# Altium schematic sheet msp430g2553.SchDoc
size A4
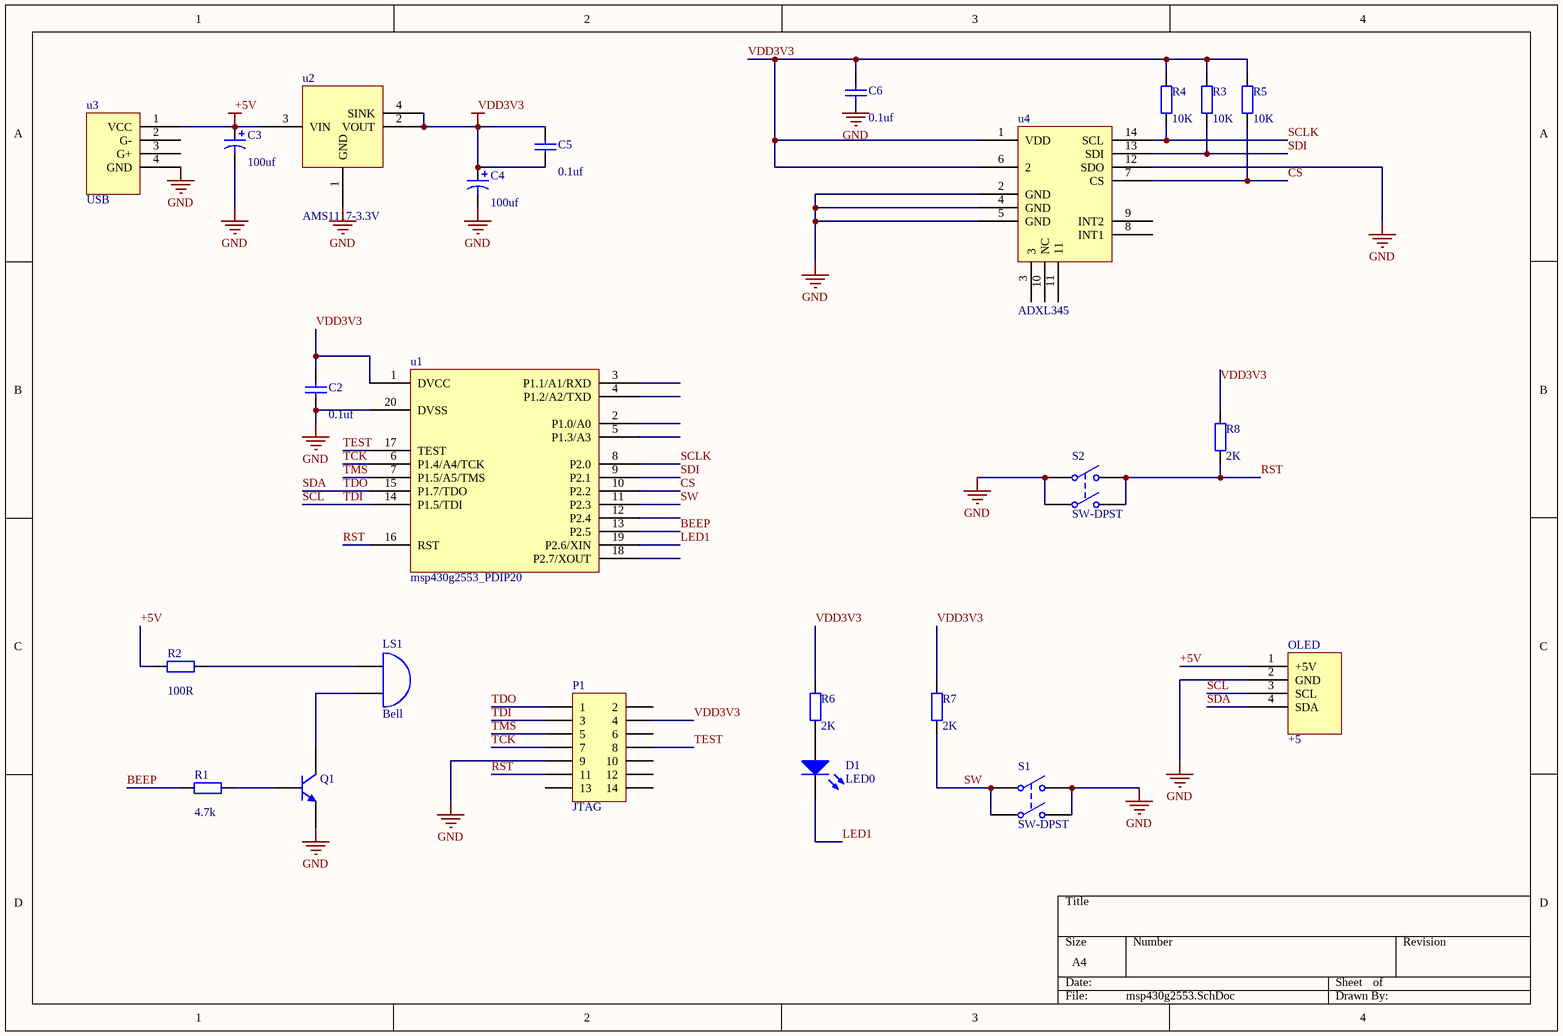
[diagram p0: msp430g2553.SchDoc]

## Parts
C2  value 0.1uf  [6-0805_N]  (hidden comment: Cap)
C3  value 100uf  [Cap2_polar]  (hidden comment: Cap Pol2)
C4  value 100uf  [Cap2_polar]  (hidden comment: Cap Pol2)
C5  value 0.1uf  [6-0805_N]  (hidden comment: Cap)
C6  value 0.1uf  [6-0805_N]  (hidden comment: Cap)
D1  LED0  [6-0805_N - duplicate]
LS1  Bell  [bell]
OLED  +5  [OLED]
P1  JTAG  [HDR2X7]
Q1  NPN  [SOT23_N]  (value not drawn)
R1  value 4.7k  [6-0805_N]  (hidden comment: Res2)
R2  value 100R  [6-0805_N]  (hidden comment: Res2)
R3  value 10K  [6-0805_N]  (hidden comment: Res2)
R4  value 10K  [6-0805_N]  (hidden comment: Res2)
R5  value 10K  [6-0805_N]  (hidden comment: Res2)
R6  value 2K  [6-0805_N]  (hidden comment: Res2)
R7  value 2K  [6-0805_N]  (hidden comment: Res2)
R8  value 2K  [6-0805_N]  (hidden comment: Res2)
S1  SW-DPST  [DPST-4]
S2  SW-DPST  [DPST-4]
u1  msp430g2553_PDIP20  [DIP20]
u2  AMS1117-3.3V  [SOT223_N]
u3  USB  [USB2.5-2H4]
u4  ADXL345  [ADXL345]

## Nets
3.3: C4.2 C5.1 C5.2 u2.2(VOUT) u2.4(SINK)
+5: C3.2 u2.3(VIN) u3.1(VCC)
GND: C2.1 C3.1 C4.1 C6.1 OLED.2(GND) P1.9 Q1.3(E) S1.3(NO1) S1.4(NO2) S2.1(COMMON1) S2.2(COMMON2) u1.20(DVSS) u2.1(GND) u3.4(GND) u4.2(GND) u4.4(GND) u4.5(GND) u4.12(SDO)
+5V: OLED.1(+5V) R2.1
BEEP: R1.1 u1.13(P2.5)
CS: R5.1 u1.10(P2.2) u4.7(CS)
LED1: D1.2(K) u1.19(P2.6/XIN)
RST: P1.11 R8.1 S2.3(NO1) S2.4(NO2) u1.16(RST)
SCL: OLED.3(SCL) P1.3 u1.14(P1.5/TDI)  [also labelled TDI]
SCLK: R4.1 u1.8(P2.0) u4.14(SCL)
SDA: OLED.4(SDA) P1.1 u1.15(P1.7/TDO)  [also labelled TDO]
SDI: R3.1 u1.9(P2.1) u4.13(SDI)
SW: R7.1 S1.1(COMMON1) S1.2(COMMON2) u1.11(P2.3)
TCK: P1.7 u1.6(P1.4/A4/TCK)
TEST: P1.8 u1.17(TEST)
TMS: P1.5 u1.7(P1.5/A5/TMS)
VDD3V3: C2.2 C6.2 P1.4 R3.2 R4.2 R5.2 R6.2 R7.2 R8.2 u1.1(DVCC) u4.1(VDD) u4.6(2)
NetD1_1: D1.1(A) R6.1
NetLS1_1: LS1.1(A) R2.2
NetLS1_2: LS1.2(B) Q1.1(C)
NetQ1_2: Q1.2(B) R1.2

Not connected (* = marked no-connect by the designer): P1 2 6 10 12 13 14; u1 2(P1.0/A0) 3(P1.1/A1/RXD) 4(P1.2/A2/TXD) 5(P1.3/A3) 12(P2.4) 18(P2.7/XOUT); u3 2(G-) 3(G+); u4 3 8(INT1) 9(INT2) 10(NC) 11

## Notes on the sheet
- Labels drawn without touching a wire or pin: +5V, VDD3V3

## Library data of the parts
C2 C5 C6 = Cap: Capacitor; Published: 8-Jun-2000; LatestRevisionDate: 17-Jul-2002; LatestRevisionNote: Re-released for DXP Platform.; PackageReference: RAD-0.3; Publisher: Altium Limited; PackageDescription: Radial Cap, Thru-Hole; 2 Leads; 0.3 in Pin Spacing
C3 C4 = Cap Pol2: Polarized Capacitor (Axial); Published: 8-Jun-2000; LatestRevisionDate: 17-Jul-2002; LatestRevisionNote: Re-released for DXP Platform.; PackageReference: POLAR0.8; Publisher: Altium Limited; PackageDescription: Polarized Capacitor; 2 Leads
D1 = LED0: Typical INFRARED GaAs LED; Published: 8-Jun-2000; LatestRevisionDate: 08-Jul-2005; LatestRevisionNote: Mech Layer 1 removed.; PackageReference: LED-0; Publisher: Altium Limited; PackageDescription: LED; 2 Leads
LS1 = Bell: Electrical Bell; Published: 24-Mar-1999; LatestRevisionDate: 17-Jul-2002; LatestRevisionNote: Re-released for DXP Platform.; PackageReference: PIN2; Publisher: Altium Limited
OLED = OLED
P1 = JTAG: Header, 7-Pin, Dual row; LatestRevisionDate: 17-Jul-2002; LatestRevisionNote: Re-released for DXP Platform.; Publisher: Altium Limited
Q1 = NPN: NPN Bipolar Transistor; Published: 8-Jun-2000; LatestRevisionDate: 17-Jul-2002; LatestRevisionNote: Re-released for DXP Platform.; PackageReference: TO-226-AA; Publisher: Altium Limited; PackageDescription: TO, Flat Index; 3 In-Line, Axial Leads; Body Dia. 4.8mm; Leads 0.55 x 0.51 mm (max); Code_JEDEC: TO-226-AA
R1-R8 = Res2: Resistor; Published: 8-Jun-2000; LatestRevisionDate: 17-Jul-2002; LatestRevisionNote: Re-released for DXP Platform.; PackageReference: AXIAL-0.4; Publisher: Altium Limited; PackageDescription: Axial Device, Thru-Hole; 2 Leads; 0.4 in Pin Spacing
S1 S2 = SW-DPST: Double-Pole, Single-Throw Switch; Published: 24-Mar-1999; LatestRevisionDate: 17-Jul-2002; LatestRevisionNote: Re-released for DXP Platform.; PackageReference: DPST-4; Publisher: Altium Limited; PackageDescription: Switch; 4 Leads